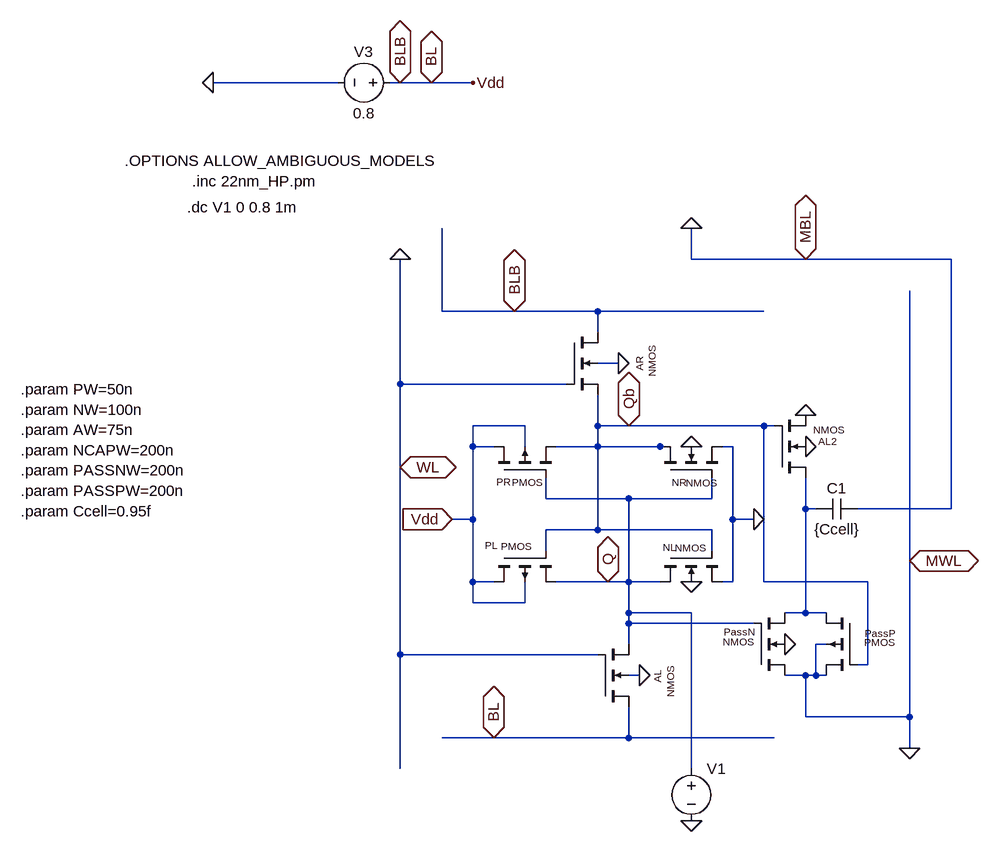
[diagram p0: schematic 9T_1C_cell.asc]
9T_1C_cell.asc, the LTspice schematic file:
Version 4.1
SHEET 1 2728 1712
WIRE -1008 -32 -1200 -32
WIRE -912 -32 -928 -32
WIRE -864 -32 -912 -32
WIRE -800 -32 -864 -32
WIRE -464 240 -464 192
WIRE -288 240 -464 240
WIRE -64 240 -288 240
WIRE -848 320 -848 192
WIRE -736 320 -848 320
WIRE -608 320 -736 320
WIRE -352 320 -608 320
WIRE -608 352 -608 320
WIRE -576 400 -608 400
WIRE -912 432 -912 240
WIRE -656 432 -912 432
WIRE -720 496 -800 496
WIRE -608 496 -608 448
WIRE -560 496 -608 496
WIRE -352 496 -560 496
WIRE -336 496 -352 496
WIRE -800 528 -800 496
WIRE -768 528 -800 528
WIRE -720 528 -720 496
WIRE -608 528 -608 496
WIRE -608 528 -672 528
WIRE -512 528 -608 528
WIRE -496 528 -512 528
WIRE -400 528 -416 528
WIRE -912 560 -912 432
WIRE -688 608 -688 576
WIRE -560 608 -688 608
WIRE -432 608 -432 576
WIRE -432 608 -560 608
WIRE -288 624 -288 576
WIRE -272 624 -288 624
WIRE -64 624 -64 240
WIRE -64 624 -208 624
WIRE -800 640 -800 528
WIRE -800 640 -832 640
WIRE -400 640 -400 528
WIRE -368 640 -400 640
WIRE -608 656 -608 528
WIRE -608 656 -688 656
WIRE -432 656 -608 656
WIRE -688 688 -688 656
WIRE -432 688 -432 656
WIRE -128 704 -128 288
WIRE -800 736 -800 640
WIRE -768 736 -800 736
WIRE -592 736 -672 736
WIRE -560 736 -560 608
WIRE -560 736 -592 736
WIRE -512 736 -560 736
WIRE -400 736 -400 640
WIRE -400 736 -416 736
WIRE -352 736 -352 496
WIRE -192 736 -352 736
WIRE -800 768 -800 736
WIRE -720 768 -720 736
WIRE -720 768 -800 768
WIRE -560 784 -560 736
WIRE -464 784 -560 784
WIRE -288 784 -288 624
WIRE -288 784 -320 784
WIRE -256 784 -288 784
WIRE -560 800 -560 784
WIRE -368 800 -560 800
WIRE -560 832 -560 800
WIRE -256 832 -272 832
WIRE -912 848 -912 560
WIRE -608 848 -912 848
WIRE -192 864 -192 736
WIRE -192 864 -208 864
WIRE -544 880 -560 880
WIRE -288 880 -320 880
WIRE -272 880 -272 832
WIRE -272 880 -288 880
WIRE -256 880 -272 880
WIRE -288 944 -288 880
WIRE -128 944 -128 704
WIRE -128 944 -288 944
WIRE -768 976 -848 976
WIRE -560 976 -560 928
WIRE -560 976 -768 976
WIRE -336 976 -560 976
WIRE -128 992 -128 944
WIRE -912 1024 -912 848
WIRE -464 1024 -464 784
FLAG -832 640 Vdd
IOPIN -832 640 In
FLAG -544 880 0
FLAG -576 400 0
FLAG -800 -32 Vdd
FLAG -1200 -32 0
FLAG -464 736 0
FLAG -464 528 0
FLAG -368 640 0
FLAG -912 560 WL
IOPIN -912 560 BiDir
FLAG -768 976 BL
IOPIN -768 976 BiDir
FLAG -736 320 BLB
IOPIN -736 320 BiDir
FLAG -288 528 0
FLAG -288 480 0
FLAG -128 704 MWL
IOPIN -128 704 BiDir
FLAG -288 240 MBL
IOPIN -288 240 BiDir
FLAG -320 832 0
FLAG -464 192 0
FLAG -128 992 0
FLAG -560 496 Qb
IOPIN -560 496 BiDir
FLAG -592 736 Q
IOPIN -592 736 BiDir
FLAG -464 1104 0
FLAG -912 240 0
FLAG -912 -32 BLB
IOPIN -912 -32 BiDir
FLAG -864 -32 BL
IOPIN -864 -32 BiDir
SYMBOL nmos4 -512 688 M90
WINDOW 0 -5 25 VLeft 1
WINDOW 3 -4 71 VLeft 1
SYMATTR InstName NL
SYMATTR Value2 l=22n w={NW}
SYMBOL nmos4 -512 576 R270
WINDOW 0 -7 18 VRight 1
WINDOW 3 -8 40 VRight 1
SYMATTR InstName NR
SYMATTR Value2 l=22n w={NW}
SYMBOL nmos4 -608 928 M180
WINDOW 0 92 56 VLeft 1
WINDOW 3 112 62 VLeft 1
SYMATTR InstName AL
SYMATTR Value2 l=22n w={AW}
SYMBOL nmos4 -656 352 R0
WINDOW 0 113 60 VLeft 1
WINDOW 3 132 69 VLeft 1
SYMATTR InstName AR
SYMATTR Value2 l=22n w={AW}
SYMBOL pmos4 -768 688 M90
WINDOW 0 -8 6 VLeft 1
WINDOW 3 -7 58 VLeft 1
SYMATTR InstName PL
SYMATTR Value2 l=22n w={PW}
SYMBOL pmos4 -768 576 R270
WINDOW 0 -6 4 VRight 1
WINDOW 3 -7 28 VRight 1
SYMATTR InstName PR
SYMATTR Value2 l=22n w={PW}
SYMBOL Voltage -912 -32 R90
WINDOW 0 -32 56 VBottom 2
WINDOW 3 32 56 VTop 2
SYMATTR InstName V3
SYMATTR Value 0.8
SYMBOL nmos4 -336 576 M180
WINDOW 0 96 56 Right 1
WINDOW 3 108 74 Right 1
SYMATTR InstName AL2
SYMATTR Value2 l=22n w={NCAPW}
SYMBOL cap -208 608 R90
WINDOW 0 0 32 VBottom 2
WINDOW 3 32 32 VTop 2
SYMATTR InstName C1
SYMATTR Value {Ccell}
SYMBOL nmos4 -368 880 M180
WINDOW 0 1 67 Right 1
WINDOW 3 1 52 Right 1
SYMATTR InstName PassN
SYMATTR Value2 l=22n w={PASSNW}
SYMBOL pmos4 -208 784 M0
WINDOW 0 -57 31 Left 1
WINDOW 3 -57 45 Left 1
SYMATTR InstName PassP
SYMATTR Value2 l=22n w={PASSPW}
SYMBOL voltage -464 1008 R0
WINDOW 123 0 0 Left 0
WINDOW 39 0 0 Left 0
SYMATTR InstName V1
SYMATTR Value ""
TEXT -1232 120 Left 2 !.inc 22nm_HP.pm
TEXT -856 88 Right 2 !.OPTIONS ALLOW_AMBIGUOUS_MODELS
TEXT -1496 440 Left 2 !.param PW=50n\n.param NW=100n\n.param AW=75n\n.param NCAPW=200n\n.param PASSNW=200n\n.param PASSPW=200n\n.param Ccell=0.95f
TEXT -1240 160 Left 2 !.dc V1 0 0.8 1m

The netlist it stands for:
* 9T_1C_cell.asc
M§NL Q Qb 0 0 NMOS l=22n w={NW}
M§NR Qb Q 0 0 NMOS l=22n w={NW}
M§AL BLB 0 Q 0 NMOS l=22n w={AW}
M§AR BLB 0 Qb 0 NMOS l=22n w={AW}
M§PL BLB Qb Q BLB PMOS l=22n w={PW}
M§PR BLB Q Qb BLB PMOS l=22n w={PW}
V3 BLB 0 0.8
M§AL2 N001 Qb 0 0 NMOS l=22n w={NCAPW}
C1 0 N001 {Ccell}
M§PassN 0 Q N001 0 NMOS l=22n w={PASSNW}
M§PassP N001 Qb 0 0 PMOS l=22n w={PASSPW}
V1 Q 0
.model NMOS NMOS
.model PMOS PMOS
.lib standard.mos
.inc 22nm_HP.pm
.OPTIONS ALLOW_AMBIGUOUS_MODELS
.param PW=50n
.param NW=100n
.param AW=75n
.param NCAPW=200n
.param PASSNW=200n
.param PASSPW=200n
.param Ccell=0.95f
.dc V1 0 0.8 1m
.backanno
.end